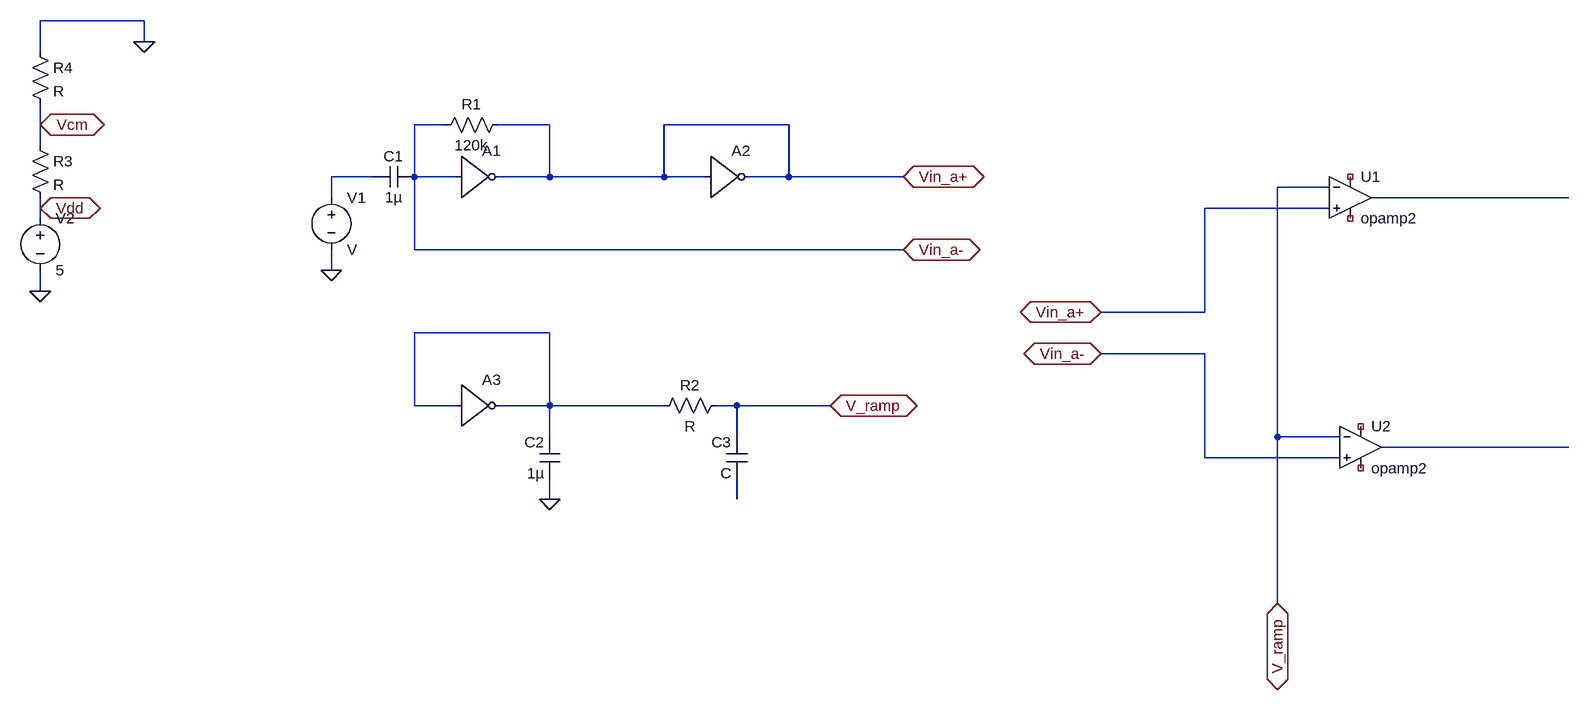
[diagram p0: schematic exp4_simulation.asc]
exp4_simulation.asc, the LTspice schematic file:
Version 4
SHEET 1 1924 916
WIRE -272 -128 -432 -128
WIRE -272 -96 -272 -128
WIRE -432 -80 -432 -128
WIRE -432 32 -432 0
WIRE 192 32 144 32
WIRE 352 32 272 32
WIRE 720 32 528 32
WIRE -432 64 -432 32
WIRE 80 112 16 112
WIRE 144 112 144 32
WIRE 208 112 144 112
WIRE 352 112 352 32
WIRE 352 112 272 112
WIRE 528 112 528 32
WIRE 528 112 352 112
WIRE 592 112 528 112
WIRE 720 112 720 32
WIRE 720 112 656 112
WIRE 896 112 720 112
WIRE 1552 128 1472 128
WIRE 16 144 16 112
WIRE 1920 144 1616 144
WIRE -432 160 -432 144
WIRE 1552 160 1360 160
WIRE -432 176 -432 160
WIRE 144 224 144 112
WIRE 896 224 144 224
WIRE 16 256 16 224
WIRE -432 288 -432 256
WIRE 1360 320 1360 160
WIRE 1360 320 1200 320
WIRE 352 352 144 352
WIRE 1360 384 1200 384
WIRE 144 464 144 352
WIRE 208 464 144 464
WIRE 352 464 352 352
WIRE 352 464 272 464
WIRE 528 464 352 464
WIRE 640 464 608 464
WIRE 784 464 640 464
WIRE 352 512 352 464
WIRE 640 512 640 464
WIRE 1472 512 1472 128
WIRE 1568 512 1472 512
WIRE 1920 528 1632 528
WIRE 1360 544 1360 384
WIRE 1568 544 1360 544
WIRE 352 608 352 576
WIRE 640 608 640 576
WIRE 1472 768 1472 512
FLAG 352 608 0
FLAG 16 256 0
FLAG 896 112 Vin_a+
IOPIN 896 112 BiDir
FLAG 896 224 Vin_a-
IOPIN 896 224 BiDir
FLAG 784 464 V_ramp
IOPIN 784 464 BiDir
FLAG -432 288 0
FLAG -272 -96 0
FLAG -432 160 Vdd
IOPIN -432 160 BiDir
FLAG -432 32 Vcm
IOPIN -432 32 BiDir
FLAG 1200 320 Vin_a+
IOPIN 1200 320 BiDir
FLAG 1200 384 Vin_a-
IOPIN 1200 384 BiDir
FLAG 1472 768 V_ramp
IOPIN 1472 768 BiDir
SYMBOL cap 144 96 R90
WINDOW 0 0 32 VBottom 2
WINDOW 3 32 32 VTop 2
SYMATTR InstName C1
SYMATTR Value 1µ
SYMBOL res 288 16 R90
WINDOW 0 0 56 VBottom 2
WINDOW 3 32 56 VTop 2
SYMATTR InstName R1
SYMATTR Value 120k
SYMBOL Digital\\inv 208 48 R0
SYMATTR InstName A1
SYMBOL Digital\\inv 592 48 R0
SYMATTR InstName A2
SYMBOL Digital\\inv 208 400 R0
SYMATTR InstName A3
SYMBOL cap 368 576 R180
WINDOW 0 24 56 Left 2
WINDOW 3 24 8 Left 2
SYMATTR InstName C2
SYMATTR Value 1µ
SYMBOL res 624 448 R90
WINDOW 0 0 56 VBottom 2
WINDOW 3 32 56 VTop 2
SYMATTR InstName R2
SYMBOL cap 656 576 R180
WINDOW 0 24 56 Left 2
WINDOW 3 24 8 Left 2
SYMATTR InstName C3
SYMBOL voltage 16 128 R0
SYMATTR InstName V1
SYMBOL voltage -432 160 R0
WINDOW 123 0 0 Left 0
WINDOW 39 0 0 Left 0
SYMATTR InstName V2
SYMATTR Value 5
SYMBOL res -448 48 R0
SYMATTR InstName R3
SYMBOL res -448 -96 R0
SYMATTR InstName R4
SYMBOL Opamps\\opamp2 1584 80 R0
SYMATTR InstName U1
SYMBOL Opamps\\opamp2 1600 464 R0
SYMATTR InstName U2

The netlist it stands for:
* exp4_simulation.asc
C1 Vin_a- N001 1µ
R1 Vin_a+ Vin_a- 120k
A1 Vin_a- 0 0 0 0 Vin_a+ 0 0 BUF
A2 Vin_a+ 0 0 0 0 Vin_a+ 0 0 BUF
A3 N003 0 0 0 0 N003 0 0 BUF
C2 0 N003 1µ
R2 V_ramp N003 R
C3 N005 V_ramp C
V1 N001 0 V
V2 Vdd 0 5
R3 Vcm Vdd R
R4 0 Vcm R
XU1 Vin_a+ V_ramp NC_01 NC_02 N002 opamp2  ; pins In+ In- V+ V- OUT
XU2 Vin_a- V_ramp NC_03 NC_04 N004 opamp2  ; pins In+ In- V+ V- OUT
.backanno
.end